# EAGLE schematic Sonde (EAGLE 8.0.2)
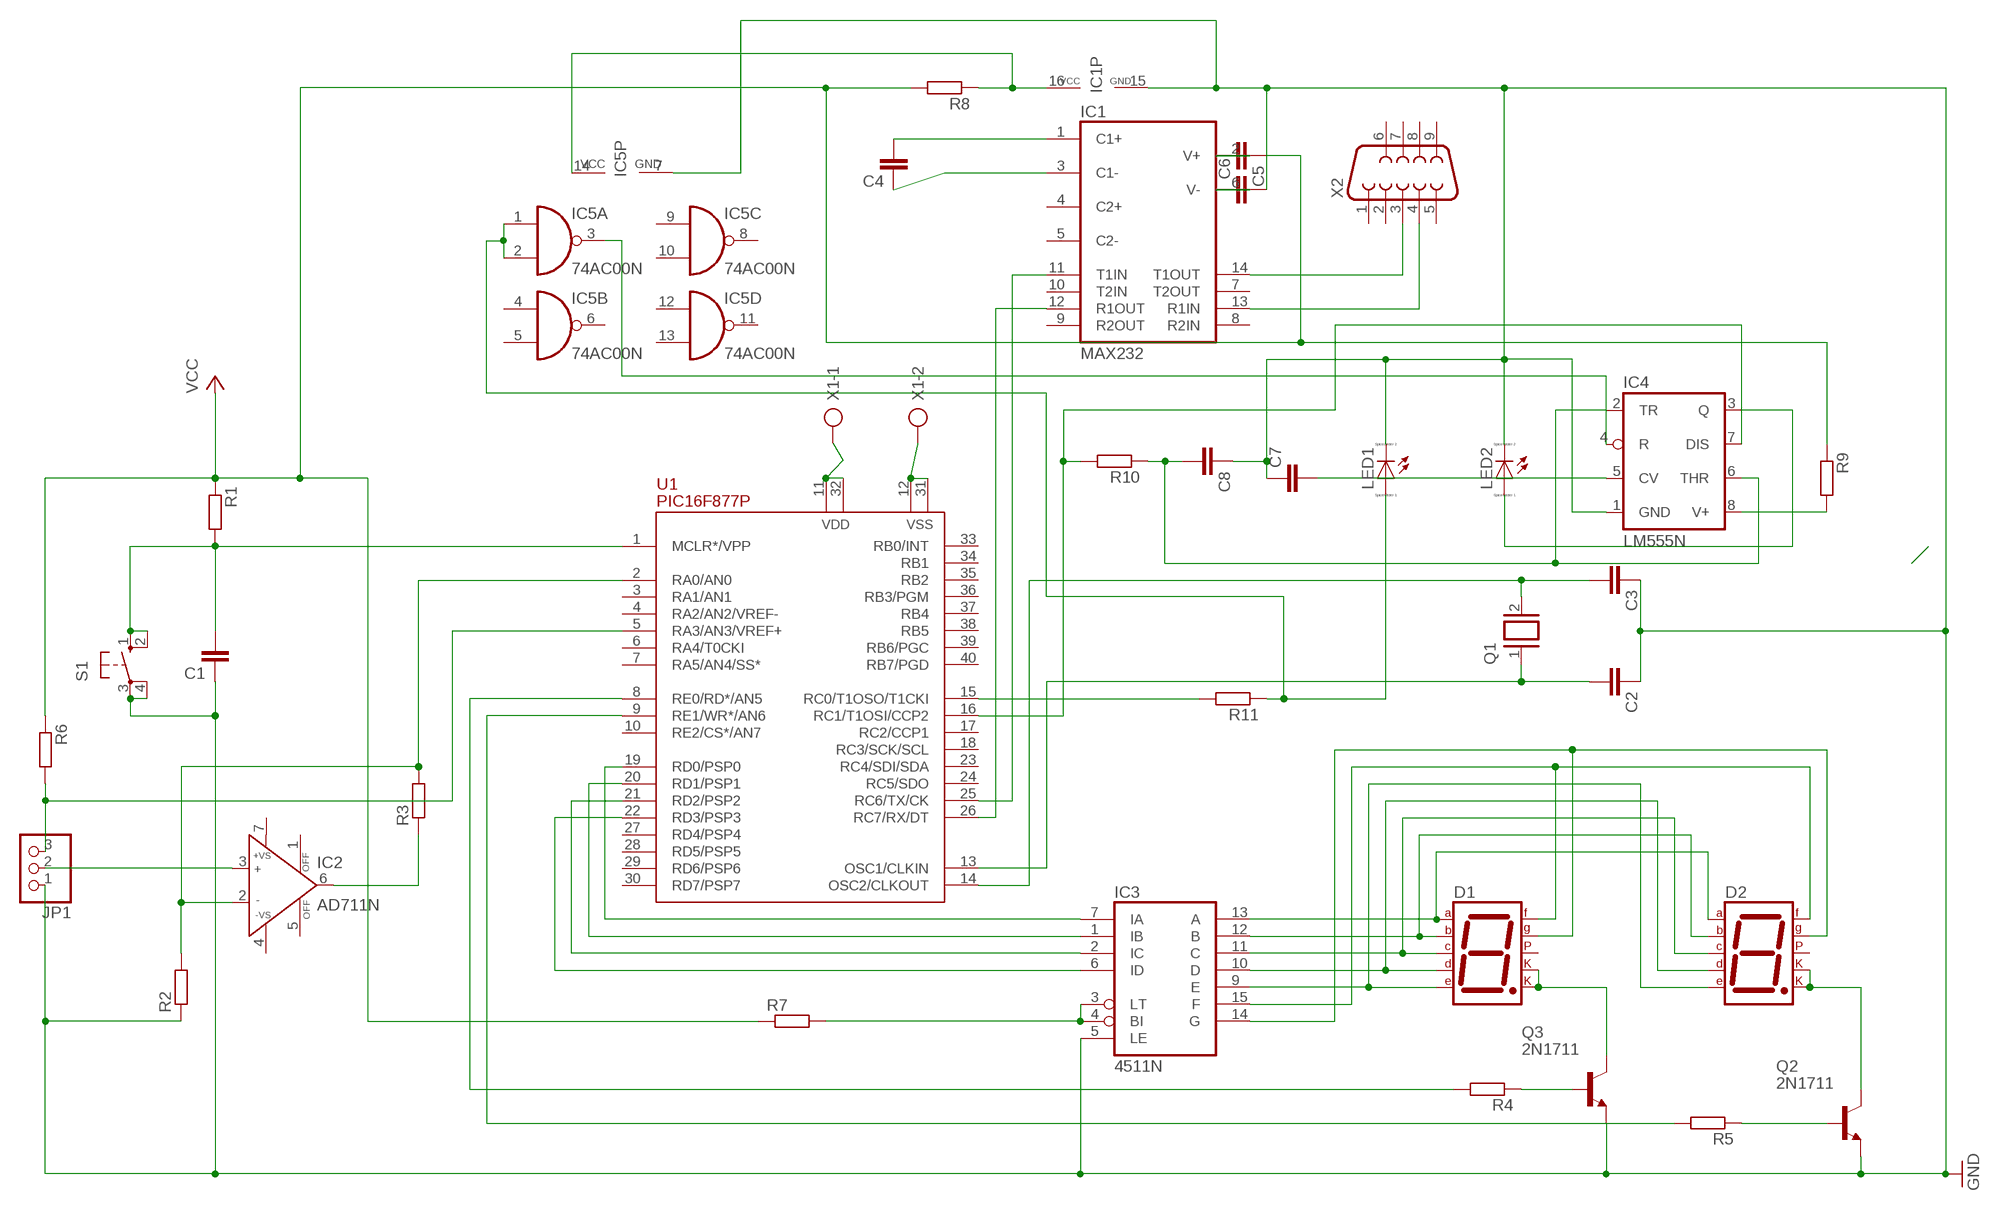
[diagram p0: schematic, sheet 1]

## Parts
C1  C-EU025-024X044  [C025-024X044]
C2  C-EU025-024X044  [C025-024X044]
C3  C-EU025-024X044  [C025-024X044]
C4  C-EU025-024X044  [C025-024X044]
C5  C-EU025-024X044  [C025-024X044]
C6  C-EU025-024X044  [C025-024X044]
C7  C-EU025-024X044  [C025-024X044]
C8  C-EU025-024X044  [C025-024X044]
D1  7SEG-CK  [7SEG-13]
D2  7SEG-CK  [7SEG-13]
IC1  MAX232  [DIL16]
IC2  AD711N  [DIL08]
IC3  4511N  [DIL16]
IC4  LM555N  [DIL08]
IC5  74AC00N  [DIL14]
JP1  PINHD-1X3  [1X03]
LED1  LED_ELD260  [LED_LD260]
LED2  LED_ELD260  [LED_LD260]
Q1  XTAL/S  [QS]
Q2  2N1711  [TO39]
Q3  2N1711  [TO39]
R1  R-EU_0207/10  [0207/10]
R2  R-EU_0207/10  [0207/10]
R3  R-EU_0207/10  [0207/10]
R4  R-EU_0207/10  [0207/10]
R5  R-EU_0207/10  [0207/10]
R6  R-EU_0207/10  [0207/10]
R7  R-EU_0207/10  [0207/10]
R8  R-EU_0207/10  [0207/10]
R9  R-EU_0207/10  [0207/10]
R10  R-EU_0207/10  [0207/10]
R11  R-EU_0207/10  [0207/10]
S1  10-XX  [B3F-10XX]
U1  PIC16F877P  [DIL40]
X1  AK300/2  [AK300/2]
X2  F09D  [F09D]

## Nets
GND: C1.1 C2.1 C3.1 C6.2 C7.1 C8.1 IC1.15(GND) IC3.5(LE) IC4.1(GND) IC5.7(P:GND) JP1.1 LED1.K(C) LED2.K(C) Q2.1(E) Q3.1(E) R2.1 S1.3(P) S1.4(P1)
N$1: U1.12(VSS) U1.31(VSS) X1.2
N$2: U1.11(VDD) U1.32(VDD) X1.1
N$3: D2.3(CK1) D2.8(CK2) Q2.3(C)
N$4: JP1.3 R6.2 U1.5(RA3/AN3/VREF+)
N$5: C2.2 Q1.1 U1.13(OSC1/CLKIN)
N$6: C3.2 Q1.2 U1.14(OSC2/CLKOUT)
N$7: D1.3(CK1) D1.8(CK2) Q3.3(C)
N$8: C1.2 R1.2 S1.1(S) S1.2(S1) U1.1(MCLR*/VPP)
N$9: Q3.2(B) R4.1
N$10: Q2.2(B) R5.1
N$11: R4.2 U1.8(RE0/RD*/AN5)
N$12: R5.2 U1.9(RE1/WR*/AN6)
N$13: D1.7(A) D2.7(A) IC3.13(A)
N$14: C5.2 IC1.2(V+)
N$15: D1.6(B) D2.6(B) IC3.12(B)
N$16: D1.4(C) D2.4(C) IC3.11(C)
N$17: D1.2(D) D2.2(D) IC3.10(D)
N$18: D1.1(E) D2.1(E) IC3.9(E)
N$19: C6.1 IC1.6(V-)
N$20: D1.9(F) D2.9(F) IC3.15(F)
N$21: IC1.11(T1IN) U1.25(RC6/TX/CK)
N$22: D1.10(G) D2.10(G) IC3.14(G)
N$23: IC1.12(R1OUT) U1.26(RC7/RX/DT)
N$24: IC2.3(IN+) JP1.2
N$25: IC2.6(OUT) R3.1
N$26: IC2.2(IN-) R2.2 R3.2 U1.2(RA0/AN0)
N$27: IC5.1(A:I0) IC5.2(A:I1) LED1.A R11.1
N$28: IC1.13(R1IN) X2.4
N$29: IC1.14(T1OUT) X2.3
N$30: IC3.7(IA) U1.19(RD0/PSP0)
N$31: IC3.1(IB) U1.20(RD1/PSP1)
N$32: IC3.2(IC) U1.21(RD2/PSP2)
N$33: IC3.6(ID) U1.22(RD3/PSP3)
N$34: C4.1 IC1.3(C1-)
N$35: C4.2 IC1.1(C1+)
N$37: IC3.3(LT) IC3.4(BI) R7.2
N$38: IC1.16(VCC) IC5.14(P:VCC) R8.1
N$39: IC4.8(V+) R9.2
N$40: IC4.3(Q) LED2.A
N$41: IC4.7(DIS) R10.2 U1.16(RC1/T1OSI/CCP2)
N$42: R11.2 U1.15(RC0/T1OSO/T1CKI)
N$43: C7.2 IC4.5(CV)
N$45: C8.2 IC4.2(TR) IC4.6(THR) R10.1
N$46: IC4.4(R) IC5.3(A:O)
VCC: C5.1 R1.1 R6.1 R7.1 R8.2 R9.1
Unconnected: D1.5(DP) D2.5(DP) IC1.4(C2+) IC1.5(C2-) IC1.7(T2OUT) IC1.8(R2IN) IC1.9(R2OUT) IC1.10(T2IN) IC2.1(OFF) IC2.4(-VS) IC2.5(OFF) IC2.7(+VS) IC5.4(B:I0) IC5.5(B:I1) IC5.6(B:O) IC5.8(C:O) IC5.9(C:I0) IC5.10(C:I1) IC5.11(D:O) IC5.12(D:I0) IC5.13(D:I1) U1.3(RA1/AN1) U1.4(RA2/AN2/VREF-) U1.6(RA4/T0CKI) U1.7(RA5/AN4/SS*) U1.10(RE2/CS*/AN7) U1.17(RC2/CCP1) U1.18(RC3/SCK/SCL) U1.23(RC4/SDI/SDA) U1.24(RC5/SDO) U1.27(RD4/PSP4) U1.28(RD5/PSP5) U1.29(RD6/PSP6) U1.30(RD7/PSP7) U1.33(RB0/INT) U1.34(RB1) U1.35(RB2) U1.36(RB3/PGM) U1.37(RB4) U1.38(RB5) U1.39(RB6/PGC) U1.40(RB7/PGD) X2.1 X2.2 X2.5 X2.6 X2.7 X2.8 X2.9

## Power pins joined to a net without a drawn wire
VDD: IC3.16(VDD)
VSS: IC3.8(VSS)

## Library data of the parts
C1-C8 = rcl:C-EU: CAPACITOR, European symbol
D1 D2 = special:7SEG-CK: 7-segment DISPLAY single cathode, 13 mm
IC1 = maxim:MAX232: RS232 TRANSCEIVER; MF: MAXIM; MPN: MAX232ACPE+; OC_FARNELL: 9723773; OC_NEWARK: 68K4544
IC2 = analog-devices:AD711: Precision, Low Cost, High Speed, BiFET Op Amp Source: http://www.analog.com/static/imported-files/data_sheets/AD711.pdf; MPN: AD711BQ; OC_FARNELL: 9604839; OC_NEWARK: 66F5826
IC3 = 45xx:4511: BCD to 7-segment LATCH/DECODER/DRIVER
IC4 = linear:*555: TIMER
IC5 = 74xx-eu:74*00: Quad 2-input NAND gate
JP1 = pinhead:PINHD-1X3: PIN HEADER
LED1 LED2 = eagle-ltspice:LED_E: LED Source: http://www.osram.convergy.de Source: www.luxeon.com Source: www.kingbright.com; SPICEMODEL: NONE; SPICEPREFIX: D; SPICETYPE: diode
Q1 = special:XTAL/S: CRYSTAL
Q2 Q3 = transistor-npn:2N1711: NPN Transistor
R1-R11 = rcl:R-EU_: RESISTOR, European symbol
S1 = switch-omron:10-XX: OMRON SWITCH; MPN: B3F-1000; OC_FARNELL: 176432; OC_NEWARK: 36M3542
U1 = pic16f87x:PIC16F877: FLASH MICROCONTROLLER
X1 = con-ptr500:AK300/2: CONNECTOR; OC_FARNELL: unknown; OC_NEWARK: unknown
X2 = con-subd:F09: SUB-D; OC_FARNELL: unknown; OC_NEWARK: unknown